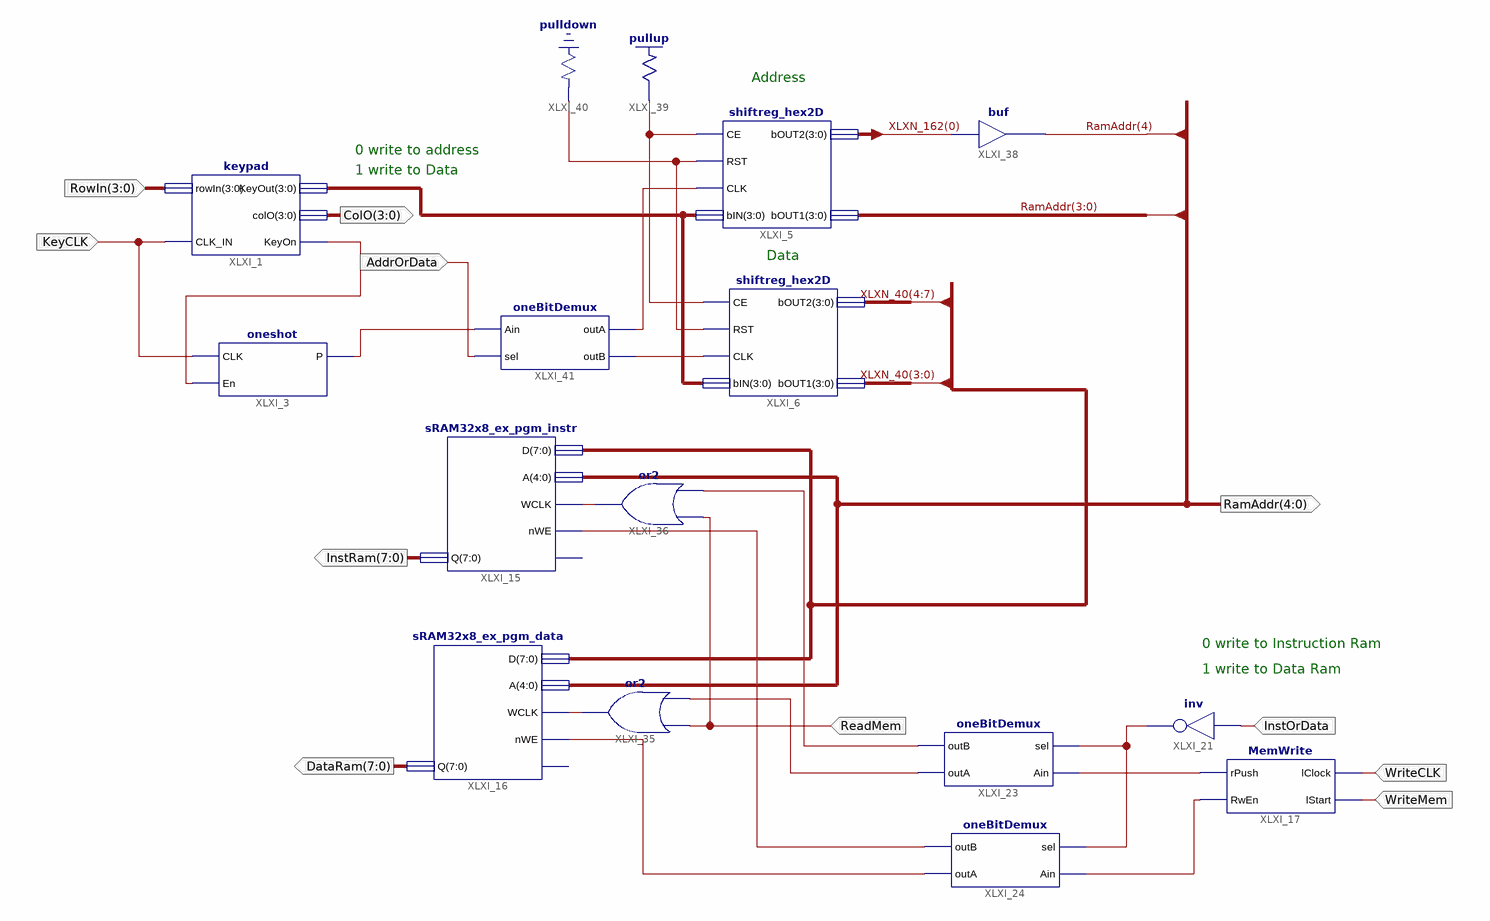
[diagram p0: schematic sheet 1]
// Xilinx ISE schematic KeyAndMem.sch (spartan3e) as structural Verilog: 16 symbols, 11 ports
module KeyAndMem (
  input  [3:0] RowIn,
  input  KeyCLK,
  input  AddrOrData,
  input  WriteCLK,
  input  WriteMem,
  input  ReadMem,
  input  InstOrData,
  output [4:0] RamAddr,
  output [7:0] DataRam,
  output [7:0] InstRam,
  output [3:0] ColO
);

  wire XLXN_9, XLXN_38, XLXN_128, XLXN_135, XLXN_138, XLXN_139, XLXN_151, XLXN_152, XLXN_153, XLXN_154,
       XLXN_167, XLXN_168, XLXN_172, XLXN_173, XLXN_175;
  wire [3:0] XLXN_162, XLXN_169;
  wire [7:0] XLXN_40;

  oneshot XLXI_3 (.CLK(KeyCLK), .En(XLXN_9), .P(XLXN_175));
  keypad XLXI_1 (.rowIn(RowIn), .CLK_IN(KeyCLK), .KeyOut(XLXN_169), .colO(ColO), .KeyOn(XLXN_9));
  shiftreg_hex2D XLXI_5 (
    .CE(XLXN_38), .RST(XLXN_168), .CLK(XLXN_172), .bIN(XLXN_169), .bOUT2(XLXN_162), .bOUT1(RamAddr[3:0]));
  shiftreg_hex2D XLXI_6 (
    .CE(XLXN_38), .RST(XLXN_168), .CLK(XLXN_173), .bIN(XLXN_169),
    .bOUT2({XLXN_40[4], XLXN_40[5], XLXN_40[6], XLXN_40[7]}), .bOUT1(XLXN_40[3:0]));
  sRAM32x8_ex_pgm_instr XLXI_15 (.nWE(XLXN_153), .WCLK(XLXN_139), .A(RamAddr), .D(XLXN_40), .Q(InstRam));  // open: nCS
  sRAM32x8_ex_pgm_data XLXI_16 (.nWE(XLXN_154), .WCLK(XLXN_138), .A(RamAddr), .D(XLXN_40), .Q(DataRam));  // open: nCS
  oneBitDemux XLXI_23 (.Ain(XLXN_167), .sel(XLXN_135), .outA(XLXN_152), .outB(XLXN_151));
  oneBitDemux XLXI_24 (.Ain(XLXN_128), .sel(XLXN_135), .outA(XLXN_154), .outB(XLXN_153));
  MemWrite XLXI_17 (.lStart(WriteMem), .lClock(WriteCLK), .RwEn(XLXN_128), .rPush(XLXN_167));
  or XLXI_35 (XLXN_138, XLXN_152, ReadMem);
  or XLXI_36 (XLXN_139, XLXN_151, ReadMem);
  buf XLXI_38 (RamAddr[4], XLXN_162[0]);
  \pullup  XLXI_39 (.O(XLXN_38));
  \pulldown  XLXI_40 (.O(XLXN_168));
  oneBitDemux XLXI_41 (.Ain(XLXN_175), .sel(AddrOrData), .outA(XLXN_172), .outB(XLXN_173));
  not XLXI_21 (XLXN_135, InstOrData);

  // Notes on the sheet:
  //   Address
  //   0 write to address
  //   1 write to Data
  //   Data
  //   0 write to Instruction Ram
  //   1 write to Data Ram
endmodule
